# EasyEDA schematic Arkbot.json
TITLE: ROBO Car Schematic; REV: 1.0; Date: 2026-07-04; Sheet: 1/1; Company: Krawfox
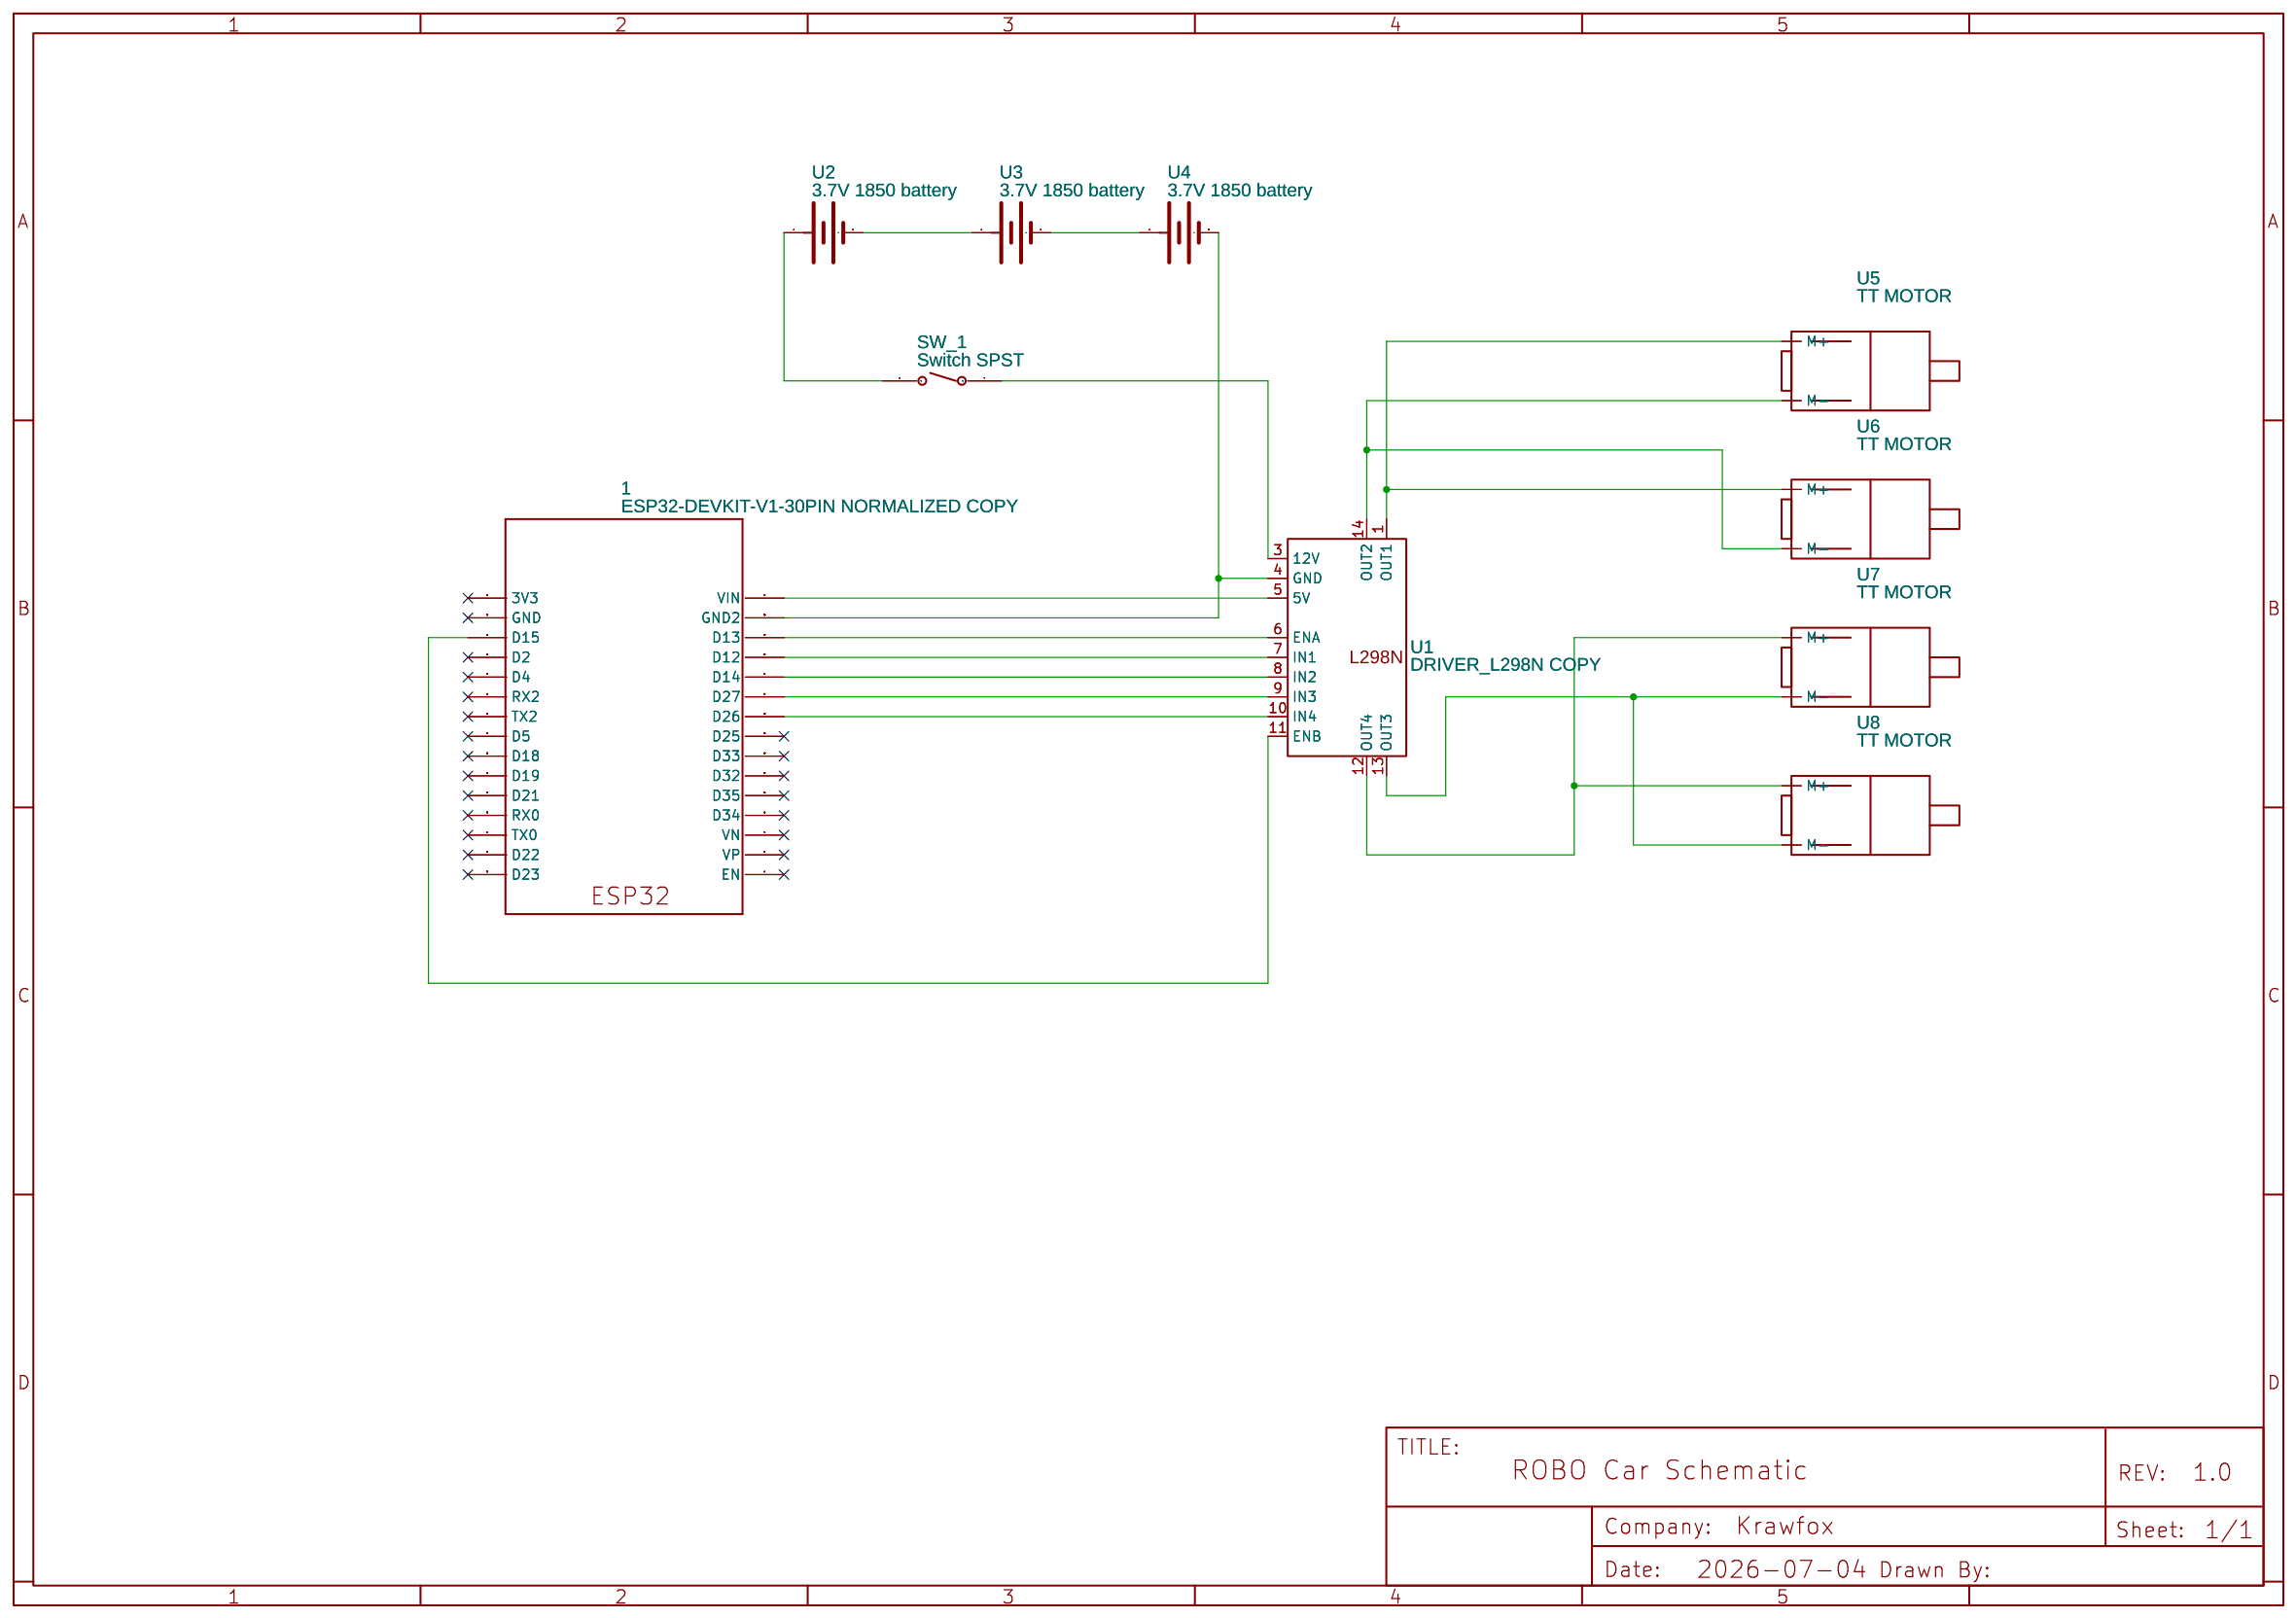
[diagram p0: schematic sheet]

## Parts
1  ESP32-DEVKIT-V1-30PIN NORMALIZED COPY  [ESP32-DEVKITV1_ESP32-DEVKITV1]
SW_1  Switch SPST  [SWITCH-SPST]
U1  DRIVER_L298N COPY  [M_L298N_AL]
U2  3.7V 1850 battery  [BAT-TH_SVC14500-3.7V-800MAH]
U3  3.7V 1850 battery  [BAT-TH_SVC14500-3.7V-800MAH]
U4  3.7V 1850 battery  [BAT-TH_SVC14500-3.7V-800MAH]
U5  TT MOTOR  [GENERIC-ELETRIC-MOTOR]
U6  TT MOTOR  [GENERIC-ELETRIC-MOTOR]
U7  TT MOTOR  [GENERIC-ELETRIC-MOTOR]
U8  TT MOTOR  [GENERIC-ELETRIC-MOTOR]

## Library data of the parts
1 = ESP32-DEVKIT-V1-30PIN: Contributor: pvillalobos.ing
SW_1 = Switch SPST: Contributor: Gord Alexiuk
U1 = DRIVER_L298N COPY: Contributor: alex.perez.81
U2-U4 = SVC14500 3.7V 800MAH: Supplier: LCSC; Supplier Part: C42404724; Manufacturer: Sharvin Power(经钛电子); Manufacturer Part: SVC14500 3.7V 800mAh; Contributor: lcsc
U5-U8 = B smart DC24V260RPM: Contributor: nitamalasmetra

## Nets
Net-(1-D12): 1.D12 U1.7(IN1)
Net-(1-D13): 1.D13 U1.6(ENA)
Net-(1-D14): 1.D14 U1.8(IN2)
Net-(1-D15): 1.D15 U1.11(ENB)
Net-(1-D26): 1.D26 U1.10(IN4)
Net-(1-D27): 1.D27 U1.9(IN3)
Net-(1-GND2): 1.GND2 U1.4(GND) U4.2(-)
Net-(1-VIN): 1.VIN U1.5(5V)
Net-(SW_1-1): SW_1.1 U1.3(12V)
Net-(SW_1-2): SW_1.2 U2.1(+)
Net-(U1-1): U1.1(OUT1) U5.1(M+) U6.1(M+)
Net-(U1-12): U1.12(OUT4) U7.1(M+) U8.1(M+)
Net-(U1-13): U1.13(OUT3) U7.2(M-) U8.2(M-)
Net-(U1-14): U1.14(OUT2) U5.2(M-) U6.2(M-)
Net-(U2-2): U2.2(-) U3.1(+)
Net-(U3-2): U3.2(-) U4.1(+)

Not connected (* = marked no-connect by the designer): 1 3V3* D2* D4* D5* D18* D19* D21* D22* D23* D25* D32* D33* D34* D35* EN* GND* RX0* RX2* TX0* TX2* VN* VP*
